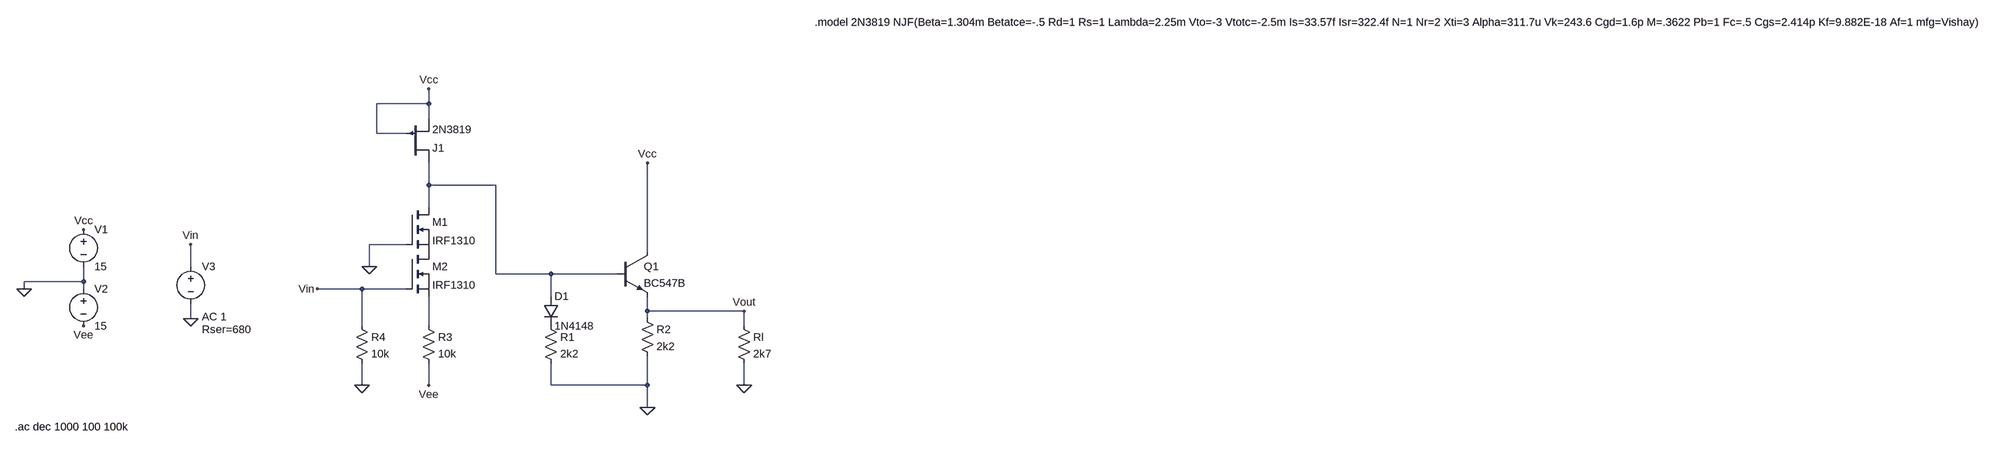
[diagram p0: schematic Draft1.asc]
Draft1.asc, the LTspice schematic file:
Version 4
SHEET 1 4768 680
WIRE 912 -64 912 -96
WIRE 912 -64 800 -64
WIRE 912 -32 912 -64
WIRE 800 0 800 -64
WIRE 864 0 800 0
WIRE 912 112 912 64
WIRE 1056 112 912 112
WIRE 912 160 912 112
WIRE 864 240 784 240
WIRE 1600 256 1600 64
WIRE -48 288 -48 240
WIRE 784 288 784 240
WIRE 1056 304 1056 112
WIRE 1392 304 1056 304
WIRE 1536 304 1392 304
WIRE -624 320 -624 288
WIRE -624 320 -752 320
WIRE -752 336 -752 320
WIRE -624 336 -624 320
WIRE 768 336 672 336
WIRE 864 336 768 336
WIRE 1392 352 1392 304
WIRE 1600 384 1600 352
WIRE 1840 384 1600 384
WIRE -48 400 -48 368
WIRE 1600 400 1600 384
WIRE 768 416 768 336
WIRE 912 416 912 352
WIRE 1840 416 1840 384
WIRE 768 544 768 496
WIRE 912 544 912 496
WIRE 1392 544 1392 496
WIRE 1600 544 1600 480
WIRE 1600 544 1392 544
WIRE 1840 544 1840 496
WIRE 1600 592 1600 544
FLAG -624 208 Vcc
FLAG 1600 64 Vcc
FLAG 784 288 0
FLAG 768 544 0
FLAG 912 -96 Vcc
FLAG 672 336 Vin
FLAG -752 336 0
FLAG -624 416 Vee
FLAG 912 544 Vee
FLAG 1600 592 0
FLAG 1840 544 0
FLAG 1840 384 Vout
FLAG -48 400 0
FLAG -48 240 Vin
SYMBOL npn 1536 256 R0
SYMATTR InstName Q1
SYMATTR Value BC547B
SYMBOL voltage -624 192 R0
WINDOW 123 0 0 Left 0
WINDOW 39 0 0 Left 0
SYMATTR InstName V1
SYMATTR Value 15
SYMBOL nmos 864 160 R0
SYMATTR InstName M1
SYMATTR Value IRF1310
SYMBOL nmos 864 256 R0
SYMATTR InstName M2
SYMATTR Value IRF1310
SYMBOL res 896 400 R0
SYMATTR InstName R3
SYMATTR Value 10k
SYMBOL res 752 400 R0
SYMATTR InstName R4
SYMATTR Value 10k
SYMBOL pjf 864 64 M180
SYMATTR InstName J1
SYMATTR Value 2N3819
SYMBOL voltage -624 320 R0
WINDOW 123 0 0 Left 0
WINDOW 39 0 0 Left 0
SYMATTR InstName V2
SYMATTR Value 15
SYMBOL diode 1376 352 R0
SYMATTR InstName D1
SYMATTR Value 1N4148
SYMBOL res 1376 400 R0
SYMATTR InstName R1
SYMATTR Value 2k2
SYMBOL res 1584 384 R0
SYMATTR InstName R2
SYMATTR Value 2k2
SYMBOL res 1824 400 R0
SYMATTR InstName Rl
SYMATTR Value 2k7
SYMBOL voltage -48 272 R0
WINDOW 123 24 124 Left 2
WINDOW 39 24 152 Left 2
SYMATTR InstName V3
SYMATTR Value ""
SYMATTR Value2 AC 1
SYMATTR SpiceLine Rser=680
TEXT -772 634 Left 2 !.ac dec 1000 100 100k
TEXT 1992 -240 Left 2 !.model 2N3819 NJF(Beta=1.304m Betatce=-.5 Rd=1 Rs=1 Lambda=2.25m Vto=-3 Vtotc=-2.5m Is=33.57f Isr=322.4f N=1 Nr=2 Xti=3 Alpha=311.7u Vk=243.6 Cgd=1.6p M=.3622 Pb=1 Fc=.5 Cgs=2.414p Kf=9.882E-18 Af=1 mfg=Vishay)

The netlist it stands for:
* Draft1.asc
Q1 Vcc N001 Vout 0 BC547B
V1 Vcc 0 15
M1 N001 0 P001 P001 IRF1310
M2 P001 Vin N002 N002 IRF1310
R3 N002 Vee 10k
R4 Vin 0 10k
J1 N001 Vcc Vcc 2N3819
V2 0 Vee 15
D1 N001 P002 1N4148
R1 P002 0 2k2
R2 Vout 0 2k2
Rl Vout 0 2k7
V3 Vin 0 AC 1 Rser=680
.model D D
.lib standard.dio
.model NPN NPN
.model PNP PNP
.lib standard.bjt
.model NJF NJF
.model PJF PJF
.lib standard.jft
.model NMOS NMOS
.model PMOS PMOS
.lib standard.mos
.ac dec 1000 100 100k
.model 2N3819 NJF(Beta=1.304m Betatce=-.5 Rd=1 Rs=1 Lambda=2.25m Vto=-3 Vtotc=-2.5m Is=33.57f Isr=322.4f N=1 Nr=2 Xti=3 Alpha=311.7u Vk=243.6 Cgd=1.6p M=.3622 Pb=1 Fc=.5 Cgs=2.414p Kf=9.882E-18 Af=1 mfg=Vishay)
.backanno
.end